# EAGLE design raspi (EAGLE 9.6.2)
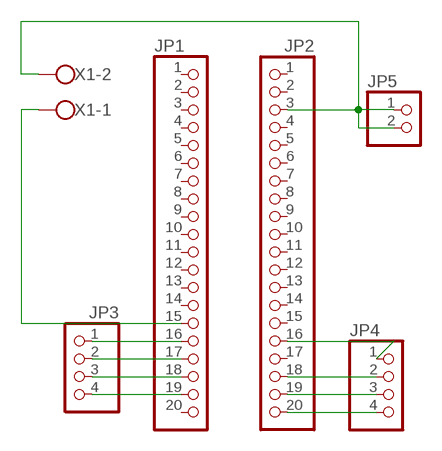
[diagram p0: schematic, sheet 1]

## Parts
JP1  PINHD-1X20  [1X20]
JP2  PINHD-1X20  [1X20]
JP3  PINHD-1X4  [1X04]
JP4  PINHD-1X4  [1X04]
JP5  PINHD-1X2  [1X02]
X1  W237-102  [W237-102]

## Nets
N$1: JP2.3 JP5.1 JP5.2 X1.2
N$2: JP2.20 JP4.4
N$3: JP2.19 JP4.3
N$4: JP2.18 JP4.2
N$5: JP2.16 JP4.1
N$6: JP1.19 JP3.4
N$7: JP1.18 JP3.3
N$8: JP1.17 JP3.2
N$9: JP1.16 JP3.1
N$11: JP1.15 X1.1
Unconnected: JP1.1 JP1.2 JP1.3 JP1.4 JP1.5 JP1.6 JP1.7 JP1.8 JP1.9 JP1.10 JP1.11 JP1.12 JP1.13 JP1.14 JP1.20 JP2.1 JP2.2 JP2.4 JP2.5 JP2.6 JP2.7 JP2.8 JP2.9 JP2.10 JP2.11 JP2.12 JP2.13 JP2.14 JP2.15 JP2.17

## Library data of the parts
JP1 JP2 = pinhead:PINHD-1X20: PIN HEADER
JP3 JP4 = pinhead:PINHD-1X4: PIN HEADER
JP5 = pinhead:PINHD-1X2: PIN HEADER
X1 = con-wago-500:W237-102: WAGO SCREW CLAMP; MPN: 237-102; OC_FARNELL: unknown; OC_NEWARK: 70K9898

## Board
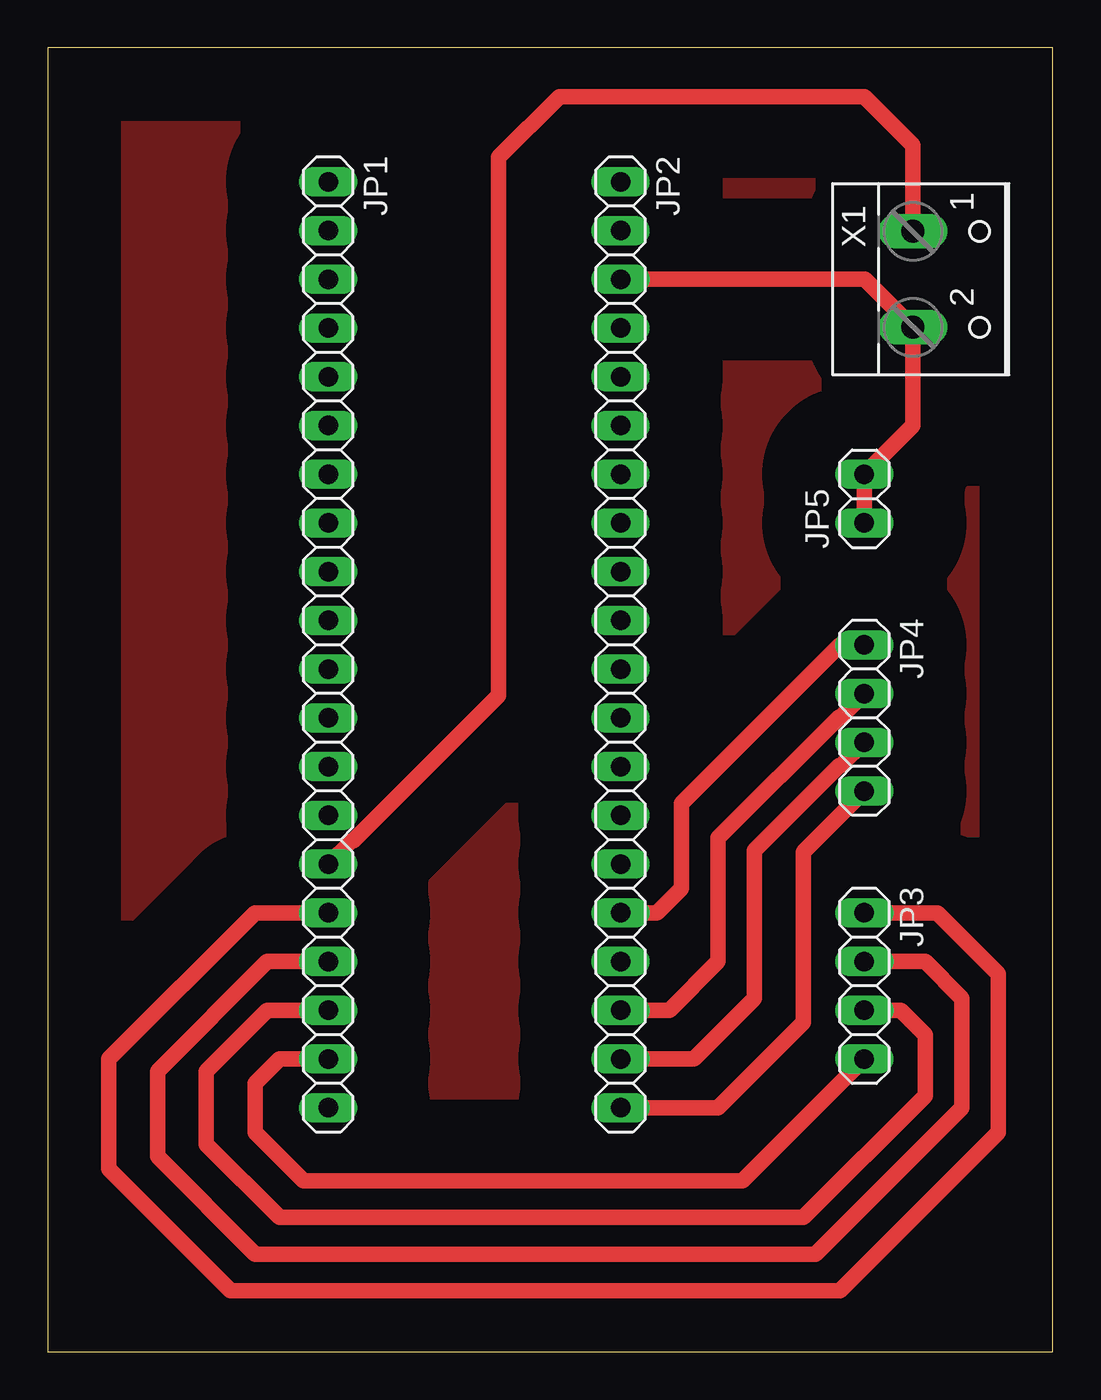
[diagram p1: board, top side]

Size 52.38 x 67.93 mm. Coordinates in mm from the lower left corner, seen from the top.
Outline: 0,0 52.38,0 52.38,67.93 0,67.93 0,0
Copper layers (1*16): Top 0.035mm / dielectric 1.5mm / Bottom 0.035mm
Design rules "default": minimum track width 6mil, minimum drill 0.35mm, track to track 6mil, track to pad 6mil, pad to pad 6mil, via to via 6mil, smd to smd 6mil, copper to edge 40mil, drill to drill 6mil, minimum pad ring 10mil, minimum via ring 8mil, stop-mask expansion 4mil, vias tented up to drill 0mil, thermal gap 10mil

### Footprints (pad centres in the part's own frame; a part is rotated, then mirrored left to right if it is on the bottom)
1X20 = drill 1.016 long: 1 -24.13,0; 2 -21.59,0; 3 -19.05,0; 4 -16.51,0; 5 -13.97,0; 6 -11.43,0; 7 -8.89,0; 8 -6.35,0; 9 -3.81,0; 10 -1.27,0; 11 1.27,0; 12 3.81,0; 13 6.35,0; 14 8.89,0; 15 11.43,0; 16 13.97,0; 17 16.51,0; 18 19.05,0; 19 21.59,0; 20 24.13,0
1X04 = drill 1.016 long: 1 -3.81,0; 2 -1.27,0; 3 1.27,0; 4 3.81,0
1X02 = drill 1.016 long: 1 -1.27,0; 2 1.27,0
W237-102 = drill 1.194 long: 1 -2.5,-1.27; 2 2.5,-1.27

### Placement (x,y rotation side)
JP1  14.61,36.83 270 top
JP2  29.84,36.83 270 top
JP3  42.55,19.05 270 top
JP4  42.55,33.02 270 top
JP5  42.55,44.45 90 top
X1  46.35,55.88 270 top

### Tracks (layer width: path | path; a pad name or v marks a point on that pad's centre or on a via)
N$1
  Top 0.813: JP2.3 42.59,55.88 X1.2 45.09,48.26 JP5.2 JP5.1
N$2
  Top 0.813: JP4.4 39.37,26.04 39.37,17.14 34.93,12.7 JP2.20
N$3
  Top 0.813: JP4.3 41.33,30.53 41.24,30.53 36.83,26.12 36.83,18.41 33.66,15.24 JP2.19
N$4
  Top 0.813: JP4.2 41.33,33.07 41.24,33.07 34.93,26.76 34.93,20.32 32.38,17.78 JP2.18
N$5
  Top 0.813: JP4.1 41.27,36.83 33.02,28.57 33.02,24.13 31.75,22.86 JP2.16
N$6
  Top 0.813: JP3.4 36.2,8.89 13.34,8.89 10.8,11.43 10.8,13.97 12.07,15.24 JP1.19
N$7
  Top 0.813: JP3.3 44.45,17.78 45.72,16.51 45.72,13.34 39.37,6.99 12.07,6.99 8.26,10.8 8.26,14.61 11.43,17.78 JP1.18
N$8
  Top 0.813: JP3.2 45.72,20.32 47.63,18.41 47.63,12.7 40.01,5.08 10.8,5.08 5.71,10.16 5.71,14.61 11.43,20.32 JP1.17
N$9
  Top 0.813: JP3.1 46.35,22.86 49.53,19.69 49.53,11.43 41.27,3.17 9.53,3.17 3.18,9.52 3.18,15.24 10.8,22.86 JP1.16
N$11
  Top 0.813: JP1.15 15.82,26.62 15.91,26.62 23.49,34.2 23.49,62.23 26.67,65.4 42.55,65.4 45.09,62.87 X1.1
POL
  pour Top (isolate 3.81): 0,67.94 0,0 52.07,0 52.07,67.94